# Altium project rs422_breakout.PrjPCB
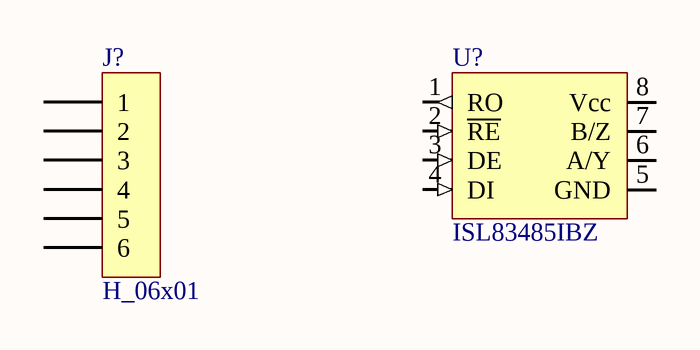
[diagram p0: rs422_breakout.SchDoc]
1 sheet, 2 parts. Net scope: global (net labels, ports and power ports of the same name join across sheets).
Board file: rs422_breakout.PcbDoc

## Sheet rs422_breakout.SchDoc
size A4

### Parts
J?  H_06x01  [H_06x01]
U?  ISL83485IBZ  [SOIC8]

### Nets

Not connected (* = marked no-connect by the designer): J? 1 2 3 4 5 6; U? 1(RO) 2(~{RE}) 3(DE) 4(DI) 5(GND) 6(A/Y) 7(B/Z) 8(Vcc)

### Library data of the parts
J? = H_06x01: Conn,
U? = ISL83485IBZ: RS-422/RS-485, 3.3V, HalfDuplex, TRN 1TX/1RX, W/SHTDN; Manufacturer: Intersil; Manufacturer Part Number: ISL83485IBZ; ComponentLink1Description: Datasheet; ComponentLink1URL: http://www.mouser.com/ds/2/465/isl83483-85-88-90-91-554566.pdf; Tolerance: *